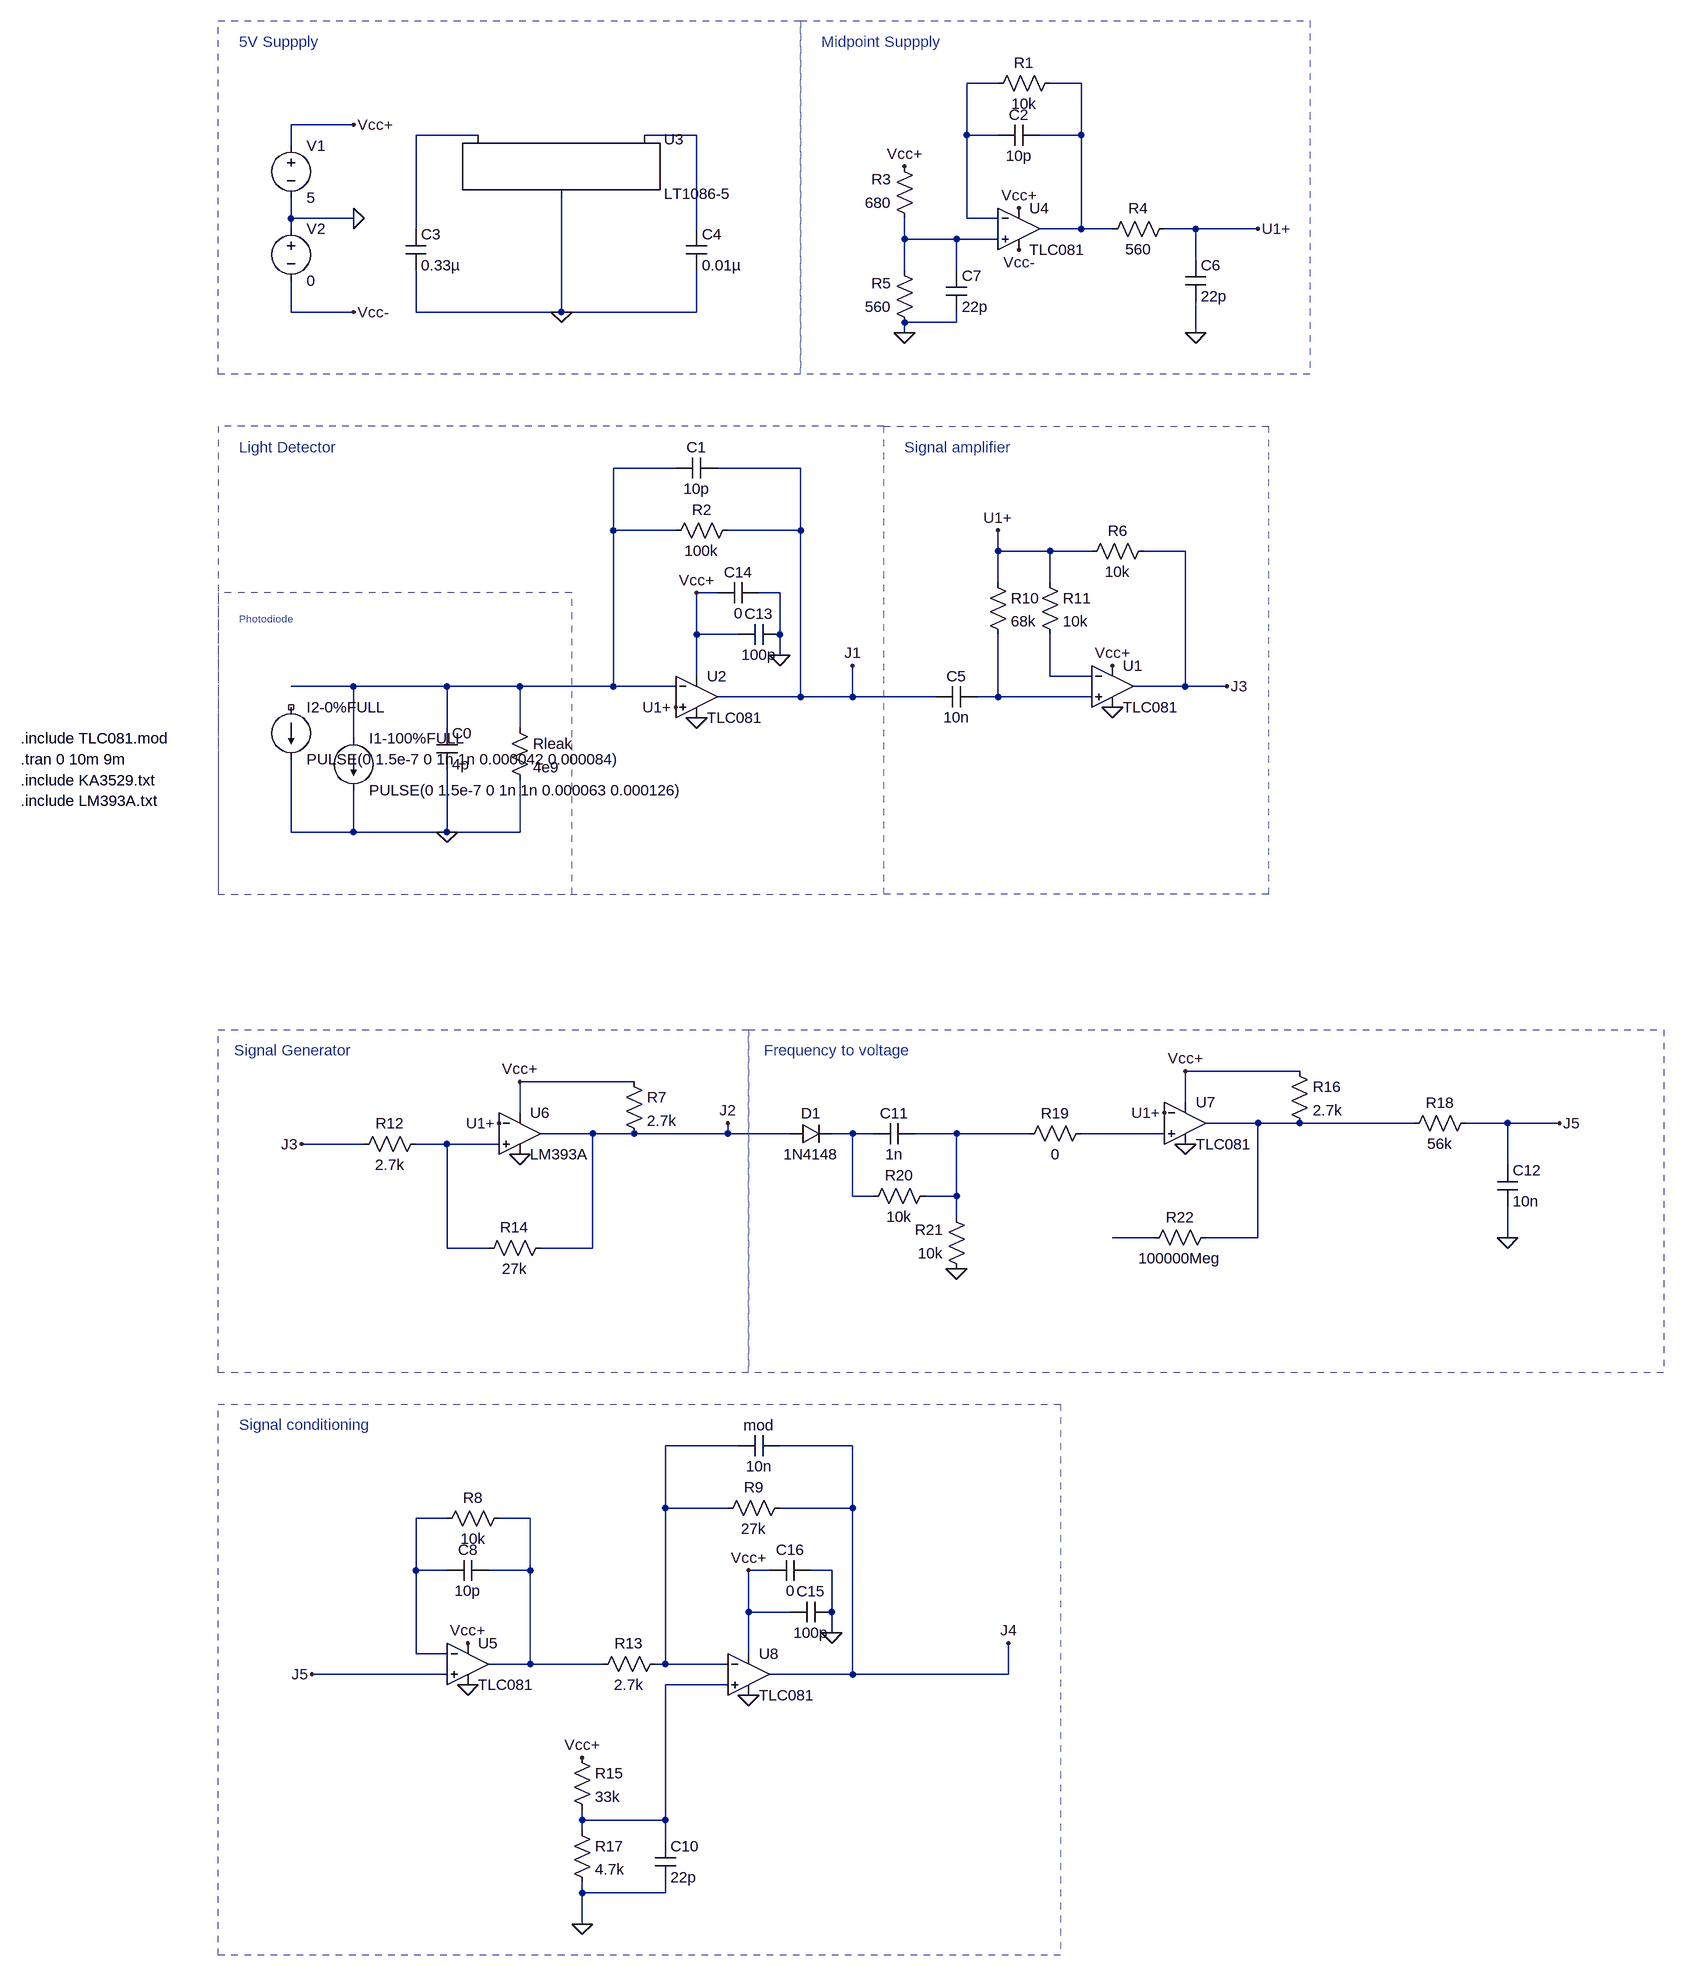
[diagram p0: schematic RX.asc]
RX.asc, the LTspice schematic file:
Version 4
SHEET 1 6580 2324
WIRE -816 -800 -864 -800
WIRE -688 -800 -736 -800
WIRE -1808 -736 -1904 -736
WIRE -1616 -720 -1712 -720
WIRE -1280 -720 -1360 -720
WIRE -864 -720 -864 -800
WIRE -816 -720 -864 -720
WIRE -688 -720 -688 -800
WIRE -688 -720 -752 -720
WIRE -1904 -704 -1904 -736
WIRE -1904 -592 -1904 -624
WIRE -1808 -592 -1904 -592
WIRE -864 -592 -864 -720
WIRE -816 -592 -864 -592
WIRE -1904 -576 -1904 -592
WIRE -1712 -576 -1712 -720
WIRE -1280 -576 -1280 -720
WIRE -688 -576 -688 -720
WIRE -688 -576 -752 -576
WIRE -640 -576 -688 -576
WIRE -512 -576 -560 -576
WIRE -416 -576 -512 -576
WIRE -960 -560 -960 -592
WIRE -880 -560 -960 -560
WIRE -816 -560 -880 -560
WIRE -512 -528 -512 -576
WIRE -960 -512 -960 -560
WIRE -880 -512 -880 -560
WIRE -1904 -448 -1904 -496
WIRE -1808 -448 -1904 -448
WIRE -1712 -448 -1712 -512
WIRE -1488 -448 -1488 -624
WIRE -1488 -448 -1712 -448
WIRE -1280 -448 -1280 -512
WIRE -1280 -448 -1488 -448
WIRE -880 -432 -880 -448
WIRE -880 -432 -960 -432
WIRE -960 -416 -960 -432
WIRE -512 -416 -512 -464
WIRE -1312 -208 -1408 -208
WIRE -1120 -208 -1248 -208
WIRE -1408 -112 -1408 -208
WIRE -1312 -112 -1408 -112
WIRE -1120 -112 -1120 -208
WIRE -1120 -112 -1232 -112
WIRE -816 -80 -816 -112
WIRE -736 -80 -816 -80
WIRE -672 -80 -736 -80
WIRE -528 -80 -592 -80
WIRE -816 -32 -816 -80
WIRE -736 -32 -736 -80
WIRE -1248 -16 -1280 -16
WIRE -1152 -16 -1184 -16
WIRE -1280 48 -1280 -16
WIRE -1216 48 -1280 48
WIRE -1152 48 -1152 -16
WIRE -1152 80 -1152 48
WIRE -1280 112 -1280 48
WIRE -736 112 -736 48
WIRE -672 112 -736 112
WIRE -1808 128 -1904 128
WIRE -1664 128 -1808 128
WIRE -1552 128 -1664 128
WIRE -1408 128 -1408 -112
WIRE -1408 128 -1552 128
WIRE -1312 128 -1408 128
WIRE -528 128 -528 -80
WIRE -528 128 -608 128
WIRE -464 128 -528 128
WIRE -1120 144 -1120 -112
WIRE -1120 144 -1248 144
WIRE -1040 144 -1040 96
WIRE -1040 144 -1120 144
WIRE -912 144 -1040 144
WIRE -816 144 -816 48
WIRE -816 144 -848 144
WIRE -672 144 -816 144
WIRE -1664 192 -1664 128
WIRE -1552 192 -1552 128
WIRE -1808 208 -1808 128
WIRE -1904 352 -1904 240
WIRE -1808 352 -1808 288
WIRE -1808 352 -1904 352
WIRE -1664 352 -1664 256
WIRE -1664 352 -1808 352
WIRE -1552 352 -1552 272
WIRE -1552 352 -1664 352
WIRE -352 720 -528 720
WIRE -1376 736 -1552 736
WIRE -528 768 -528 720
WIRE -1552 784 -1552 736
WIRE -416 800 -496 800
WIRE -352 800 -416 800
WIRE -176 800 -352 800
WIRE -32 800 -96 800
WIRE 48 800 -32 800
WIRE -1440 816 -1520 816
WIRE -1376 816 -1440 816
WIRE -1232 816 -1232 800
WIRE -1232 816 -1376 816
WIRE -1136 816 -1232 816
WIRE -1040 816 -1072 816
WIRE -1008 816 -1040 816
WIRE -880 816 -944 816
WIRE -768 816 -880 816
WIRE -560 816 -688 816
WIRE -1792 832 -1888 832
WIRE -1664 832 -1712 832
WIRE -1584 832 -1664 832
WIRE -32 864 -32 800
WIRE -1040 912 -1040 816
WIRE -1008 912 -1040 912
WIRE -880 912 -880 816
WIRE -880 912 -928 912
WIRE -880 944 -880 912
WIRE -576 976 -640 976
WIRE -416 976 -416 800
WIRE -416 976 -496 976
WIRE -32 976 -32 928
WIRE -1664 992 -1664 832
WIRE -1600 992 -1664 992
WIRE -1440 992 -1440 816
WIRE -1440 992 -1520 992
WIRE -1216 1296 -1328 1296
WIRE -1040 1296 -1152 1296
WIRE -1328 1392 -1328 1296
WIRE -1232 1392 -1328 1392
WIRE -1040 1392 -1040 1296
WIRE -1040 1392 -1152 1392
WIRE -1664 1408 -1712 1408
WIRE -1536 1408 -1584 1408
WIRE -1712 1488 -1712 1408
WIRE -1664 1488 -1712 1488
WIRE -1536 1488 -1536 1408
WIRE -1536 1488 -1600 1488
WIRE -1168 1488 -1200 1488
WIRE -1072 1488 -1104 1488
WIRE -1200 1552 -1200 1488
WIRE -1136 1552 -1200 1552
WIRE -1072 1552 -1072 1488
WIRE -1072 1584 -1072 1552
WIRE -1712 1616 -1712 1488
WIRE -1664 1616 -1712 1616
WIRE -1200 1616 -1200 1552
WIRE -1536 1632 -1536 1488
WIRE -1536 1632 -1600 1632
WIRE -1424 1632 -1536 1632
WIRE -1328 1632 -1328 1392
WIRE -1328 1632 -1344 1632
WIRE -1232 1632 -1328 1632
WIRE -1664 1648 -1872 1648
WIRE -1040 1648 -1040 1392
WIRE -1040 1648 -1168 1648
WIRE -800 1648 -800 1600
WIRE -800 1648 -1040 1648
WIRE -1232 1664 -1328 1664
WIRE -1456 1872 -1456 1856
WIRE -1328 1872 -1328 1664
WIRE -1328 1872 -1456 1872
WIRE -1456 1888 -1456 1872
WIRE -1328 1904 -1328 1872
WIRE -1456 1984 -1456 1968
WIRE -1328 1984 -1328 1968
WIRE -1328 1984 -1456 1984
WIRE -1456 2032 -1456 1984
FLAG -1808 -592 0
FLAG -1808 -736 Vcc+
FLAG -1808 -448 Vcc-
FLAG -1488 -448 0
FLAG -960 -672 Vcc+
FLAG -784 -608 Vcc+
FLAG -784 -544 Vcc-
FLAG -512 -416 0
FLAG -960 -416 0
FLAG -1664 352 0
FLAG -1280 -16 Vcc+
FLAG -1312 160 U1+
FLAG -1280 176 0
FLAG -1152 80 0
FLAG -640 96 Vcc+
FLAG -816 -112 U1+
FLAG -640 160 0
FLAG -1040 96 J1
FLAG -464 128 J3
FLAG -1888 832 J3
FLAG -1552 736 Vcc+
FLAG -1584 800 U1+
FLAG -1552 848 0
FLAG -880 1024 0
FLAG -528 832 0
FLAG -528 720 Vcc+
FLAG -560 784 U1+
FLAG -32 976 0
FLAG -1632 1600 Vcc+
FLAG -1632 1664 0
FLAG -1200 1488 Vcc+
FLAG -1200 1680 0
FLAG -1072 1584 0
FLAG -1456 1776 Vcc+
FLAG 48 800 J5
FLAG -1872 1648 J5
FLAG -1232 800 J2
FLAG -800 1600 J4
FLAG -416 -576 U1+
FLAG -1456 2032 0
SYMBOL voltage -1904 -720 R0
WINDOW 123 0 0 Left 0
WINDOW 39 0 0 Left 0
SYMATTR InstName V1
SYMATTR Value 5
SYMBOL voltage -1904 -592 R0
WINDOW 123 0 0 Left 0
WINDOW 39 0 0 Left 0
SYMATTR InstName V2
SYMATTR Value 0
SYMBOL cap -1728 -576 R0
SYMATTR InstName C3
SYMATTR Value 0.33µ
SYMBOL cap -1296 -576 R0
SYMATTR InstName C4
SYMATTR Value 0.01µ
SYMBOL PowerProducts\\LT1086-5 -1488 -720 R0
SYMATTR InstName U3
SYMBOL OpAmps\\opamp2 -784 -640 R0
SYMATTR InstName U4
SYMATTR Value TLC081
SYMBOL res -720 -816 R90
WINDOW 0 0 56 VBottom 2
WINDOW 3 32 56 VTop 2
SYMATTR InstName R1
SYMATTR Value 10k
SYMBOL res -944 -576 R180
WINDOW 0 36 76 Left 2
WINDOW 3 36 40 Left 2
SYMATTR InstName R3
SYMATTR Value 680
SYMBOL res -656 -560 R270
WINDOW 0 32 56 VTop 2
WINDOW 3 0 56 VBottom 2
SYMATTR InstName R4
SYMATTR Value 560
SYMBOL res -944 -416 R180
WINDOW 0 36 76 Left 2
WINDOW 3 36 40 Left 2
SYMATTR InstName R5
SYMATTR Value 560
SYMBOL cap -752 -736 R90
WINDOW 0 0 32 VBottom 2
WINDOW 3 32 32 VTop 2
SYMATTR InstName C2
SYMATTR Value 10p
SYMBOL cap -528 -528 R0
SYMATTR InstName C6
SYMATTR Value 22p
SYMBOL cap -896 -512 R0
SYMATTR InstName C7
SYMATTR Value 22p
SYMBOL current -1808 208 R0
WINDOW 123 0 0 Left 0
WINDOW 39 0 0 Left 0
SYMATTR InstName I1-100%FULL
SYMATTR Value PULSE(0 1.5e-7 0 1n 1n 0.000063 0.000126)
SYMBOL cap -1680 192 R0
SYMATTR InstName C0
SYMATTR Value 4p
SYMBOL OpAmps\\opamp2 -1280 80 R0
SYMATTR InstName U2
SYMATTR Value TLC081
SYMBOL cap -1248 -224 R90
WINDOW 0 0 32 VBottom 2
WINDOW 3 32 32 VTop 2
SYMATTR InstName C1
SYMATTR Value 10p
SYMBOL res -1216 -128 R90
WINDOW 0 0 56 VBottom 2
WINDOW 3 32 56 VTop 2
SYMATTR InstName R2
SYMATTR Value 100k
SYMBOL cap -1184 -32 R90
WINDOW 0 0 32 VBottom 2
WINDOW 3 32 32 VTop 2
SYMATTR InstName C14
SYMATTR Value 0
SYMBOL cap -1152 32 R90
WINDOW 0 0 32 VBottom 2
WINDOW 3 32 32 VTop 2
SYMATTR InstName C13
SYMATTR Value 100p
SYMBOL res -1568 176 R0
SYMATTR InstName Rleak
SYMATTR Value 4e9
SYMBOL OpAmps\\opamp2 -640 64 R0
SYMATTR InstName U1
SYMATTR Value TLC081
SYMBOL cap -848 128 R90
WINDOW 0 0 32 VBottom 2
WINDOW 3 32 32 VTop 2
SYMATTR InstName C5
SYMATTR Value 10n
SYMBOL res -832 -48 R0
SYMATTR InstName R10
SYMATTR Value 68k
SYMBOL res -752 -48 R0
SYMATTR InstName R11
SYMATTR Value 10k
SYMBOL res -576 -96 R90
WINDOW 0 0 56 VBottom 2
WINDOW 3 32 56 VTop 2
SYMATTR InstName R6
SYMATTR Value 10k
SYMBOL OpAmps\\opamp2 -1552 752 R0
SYMATTR InstName U6
SYMATTR Value LM393A
SYMBOL res -1392 720 R0
SYMATTR InstName R7
SYMATTR Value 2.7k
SYMBOL res -1696 816 R90
WINDOW 0 0 56 VBottom 2
WINDOW 3 32 56 VTop 2
SYMATTR InstName R12
SYMATTR Value 2.7k
SYMBOL res -1504 976 R90
WINDOW 0 0 56 VBottom 2
WINDOW 3 32 56 VTop 2
SYMATTR InstName R14
SYMATTR Value 27k
SYMBOL diode -1136 832 R270
WINDOW 0 32 32 VTop 2
WINDOW 3 0 32 VBottom 2
SYMATTR InstName D1
SYMATTR Value 1N4148
SYMBOL cap -944 800 R90
WINDOW 0 0 32 VBottom 2
WINDOW 3 32 32 VTop 2
SYMATTR InstName C11
SYMATTR Value 1n
SYMBOL res -912 896 R90
WINDOW 0 0 56 VBottom 2
WINDOW 3 32 56 VTop 2
SYMATTR InstName R20
SYMATTR Value 10k
SYMBOL res -864 1040 R180
WINDOW 0 36 76 Left 2
WINDOW 3 36 40 Left 2
SYMATTR InstName R21
SYMATTR Value 10k
SYMBOL OpAmps\\opamp2 -528 736 R0
SYMATTR InstName U7
SYMATTR Value TLC081
SYMBOL res -672 800 R90
WINDOW 0 0 56 VBottom 2
WINDOW 3 32 56 VTop 2
SYMATTR InstName R19
SYMATTR Value 0
SYMBOL res -480 960 R90
WINDOW 0 0 56 VBottom 2
WINDOW 3 32 56 VTop 2
SYMATTR InstName R22
SYMATTR Value 100000Meg
SYMBOL res -368 704 R0
SYMATTR InstName R16
SYMATTR Value 2.7k
SYMBOL cap -48 864 R0
SYMATTR InstName C12
SYMATTR Value 10n
SYMBOL res -80 784 R90
WINDOW 0 0 56 VBottom 2
WINDOW 3 32 56 VTop 2
SYMATTR InstName R18
SYMATTR Value 56k
SYMBOL OpAmps\\opamp2 -1632 1568 R0
SYMATTR InstName U5
SYMATTR Value TLC081
SYMBOL res -1568 1392 R90
WINDOW 0 0 56 VBottom 2
WINDOW 3 32 56 VTop 2
SYMATTR InstName R8
SYMATTR Value 10k
SYMBOL res -1440 1648 R270
WINDOW 0 32 56 VTop 2
WINDOW 3 0 56 VBottom 2
SYMATTR InstName R13
SYMATTR Value 2.7k
SYMBOL cap -1600 1472 R90
WINDOW 0 0 32 VBottom 2
WINDOW 3 32 32 VTop 2
SYMATTR InstName C8
SYMATTR Value 10p
SYMBOL OpAmps\\opamp2 -1200 1584 R0
SYMATTR InstName U8
SYMATTR Value TLC081
SYMBOL res -1136 1376 R90
WINDOW 0 0 56 VBottom 2
WINDOW 3 32 56 VTop 2
SYMATTR InstName R9
SYMATTR Value 27k
SYMBOL cap -1104 1472 R90
WINDOW 0 0 32 VBottom 2
WINDOW 3 32 32 VTop 2
SYMATTR InstName C16
SYMATTR Value 0
SYMBOL cap -1072 1536 R90
WINDOW 0 0 32 VBottom 2
WINDOW 3 32 32 VTop 2
SYMATTR InstName C15
SYMATTR Value 100p
SYMBOL cap -1344 1904 R0
SYMATTR InstName C10
SYMATTR Value 22p
SYMBOL res -1472 1872 R0
SYMATTR InstName R17
SYMATTR Value 4.7k
SYMBOL res -1472 1760 R0
SYMATTR InstName R15
SYMATTR Value 33k
SYMBOL cap -1152 1280 R90
WINDOW 0 0 32 VBottom 2
WINDOW 3 32 32 VTop 2
SYMATTR InstName mod
SYMATTR Value 10n
SYMBOL current -1904 160 R0
WINDOW 123 0 0 Left 0
WINDOW 39 0 0 Left 0
SYMATTR InstName I2-0%FULL
SYMATTR Value PULSE(0 1.5e-7 0 1n 1n 0.000042 0.000084)
TEXT -2320 208 Left 2 !.include TLC081.mod
TEXT -2320 240 Left 2 !.tran 0 10m 9m
TEXT -2320 272 Left 2 !.include KA3529.txt
TEXT -2320 304 Left 2 !.include LM393A.txt
TEXT -1984 -240 Left 2 ;Light Detector
TEXT -1992 688 Left 2 ;Signal Generator
TEXT -1984 24 Left 1 ;Photodiode
TEXT -960 -240 Left 2 ;Signal amplifier
TEXT -1088 -864 Left 2 ;Midpoint Suppply
TEXT -1984 -864 Left 2 ;5V Suppply
TEXT -1984 1264 Left 2 ;Signal conditioning
TEXT -1176 688 Left 2 ;Frequency to voltage
LINE Normal -1200 1184 -1200 656 2
RECTANGLE Normal -1120 -352 -2016 -896 2
RECTANGLE Normal -336 -352 -1120 -896 2
RECTANGLE Normal -400 448 -992 -272 2
RECTANGLE Normal -720 2080 -2016 1232 2
RECTANGLE Normal -2016 448 -992 -272 2
RECTANGLE Normal -1472 -16 -2016 448 2
RECTANGLE Normal -2016 656 -1200 1184 2
RECTANGLE Normal 208 1184 -1200 656 2

The netlist it stands for:
* RX.asc
V1 Vcc+ 0 5
V2 0 Vcc- 0
C3 N003 0 0.33µ
C4 N004 0 0.01µ
XU3 0 N004 N003 LT1086-5
XU4 N005 N001 Vcc+ Vcc- N002 TLC081  ; pins In+ In- V+ V- OUT
R1 N002 N001 10k
R3 N005 Vcc+ 680
R4 N002 U1+ 560
R5 0 N005 560
C2 N002 N001 10p
C6 U1+ 0 22p
C7 N005 0 22p
I1-100%FULL N006 0 PULSE(0 1.5e-7 0 1n 1n 0.000063 0.000126)
C0 N006 0 4p
XU2 U1+ N006 Vcc+ 0 J1 TLC081  ; pins In+ In- V+ V- OUT
C1 J1 N006 10p
R2 J1 N006 100k
C14 0 Vcc+ 0
C13 0 Vcc+ 100p
Rleak N006 0 4e9
XU1 N008 N007 Vcc+ 0 J3 TLC081  ; pins In+ In- V+ V- OUT
C5 N008 J1 10n
R10 U1+ N008 68k
R11 U1+ N007 10k
R6 J3 U1+ 10k
XU6 N013 U1+ Vcc+ 0 J2 LM393A  ; pins In+ In- V+ V- OUT
R7 Vcc+ J2 2.7k
R12 N013 J3 2.7k
R14 J2 N013 27k
D1 J2 N010 1N4148
C11 N011 N010 1n
R20 N011 N010 10k
R21 0 N011 10k
XU7 N012 U1+ Vcc+ 0 N009 TLC081  ; pins In+ In- V+ V- OUT
R19 N012 N011 0
R22 N009 N014 100000Meg
R16 Vcc+ N009 2.7k
C12 J5 0 10n
R18 J5 N009 56k
XU5 J5 N016 Vcc+ 0 N017 TLC081  ; pins In+ In- V+ V- OUT
R8 N017 N016 10k
R13 N017 N015 2.7k
C8 N017 N016 10p
XU8 N018 N015 Vcc+ 0 J4 TLC081  ; pins In+ In- V+ V- OUT
R9 J4 N015 27k
C16 0 Vcc+ 0
C15 0 Vcc+ 100p
C10 N018 0 22p
R17 N018 0 4.7k
R15 Vcc+ N018 33k
C§mod J4 N015 10n
I2-0%FULL NC_01 0 PULSE(0 1.5e-7 0 1n 1n 0.000042 0.000084)
.model D D
.lib standard.dio
.include TLC081.mod
.tran 0 10m 9m
.include KA3529.txt
.include LM393A.txt
* Light Detector
* Signal Generator
* Photodiode
* Signal amplifier
* Midpoint Suppply
* 5V Suppply
* Signal conditioning
* Frequency to voltage
.backanno
.end